# EAGLE design ELEKTRA-PMIC v0.1-20240112 (EAGLE 9.6.2)
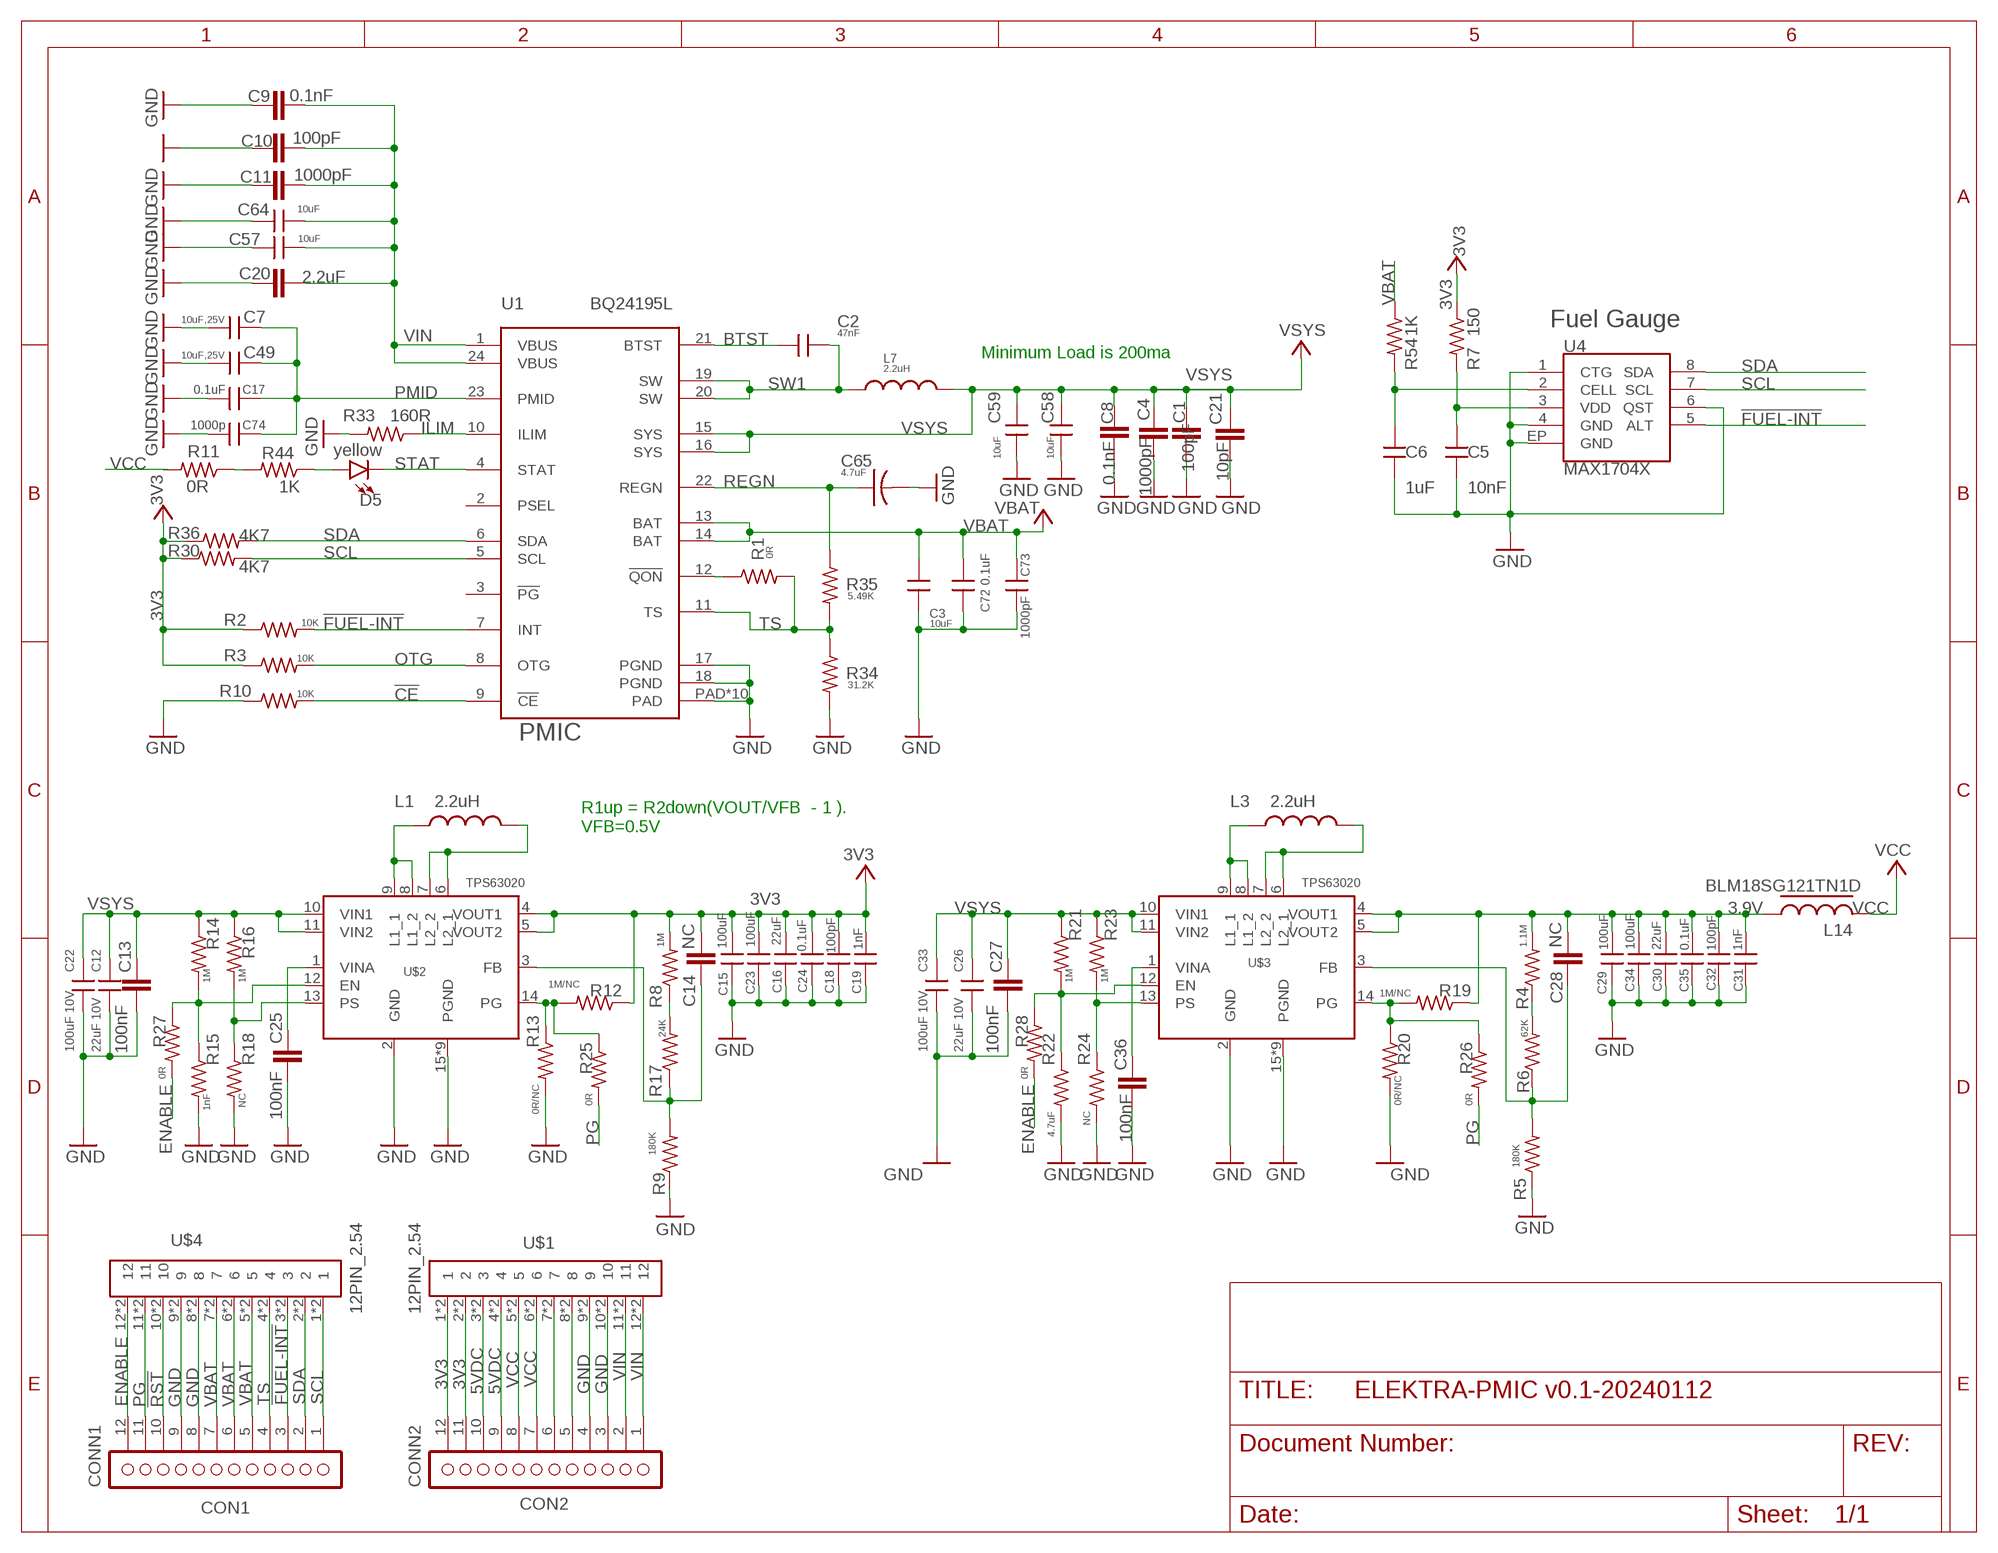
[diagram p0: schematic, sheet 1]

## Parts
C1  100pF  CAP_1  [C0402_B]
C2  47nF  CAP0402  [C-0402]
C3  10uF  CAPC0603  [C0603]
C4  1000pF  CAP_1  [C0402_B]
C5  10nF  CAP0402A  [C0402]
C6  1uF  CAP0402A  [C0402]
C7  10uF,25V  CAP0603A  [C-0603A]
C8  0.1nF  CAP_1  [C0402_B]
C9  0.1nF  CAP_1  [C0402_B]
C10  100pF  CAP_1  [C0402_B]
C11  1000pF  CAP_1  [C0402_B]
C12  22uF 10V  CAPC0805  [C0805]
C13  100nF  CAP_1  [C0402_B]
C14  NC  CAP_1  [C0402_B]
C15  100uF  CAPC1206  [C1206]
C16  22uF  CAP0603A  [C-0603A]
C17  0.1uF  CAP0402A  [C0402]
C18  100pF  CAP0402A  [C0402]
C19  1nF  CAP0402A  [C0402]
C20  2.2uF  CAP_1  [C0402_B]
C21  10pF  CAP_1  [C0402_B]
C22  100uF 10V  CAPC1206  [C1206]
C23  100uF  CAPC1206  [C1206]
C24  0.1uF  CAP0402A  [C0402]
C25  100nF  CAP_1  [C0402_B]
C26  22uF 10V  CAPC0805  [C0805]
C27  100nF  CAP_1  [C0402_B]
C28  NC  CAP_1  [C0402_B]
C29  100uF  CAPC1206  [C1206]
C30  22uF  CAP0603A  [C-0603A]
C31  1nF  CAP0402A  [C0402]
C32  100pF  CAP0402A  [C0402]
C33  100uF 10V  CAPC1206  [C1206]
C34  100uF  CAPC1206  [C1206]
C35  0.1uF  CAP0402A  [C0402]
C36  100nF  CAP_1  [C0402_B]
C49  10uF,25V  CAP0603A  [C-0603A]
C57  10uF  CAP0603A  [C-0603A]
C58  10uF  CAP0603A  [C-0603A]
C59  10uF  CAP0603A  [C-0603A]
C64  10uF  CAP0603A  [C-0603A]
C65  4.7uF  C-US0603  [C0603_B]
C72  0.1uF  CAP0402  [C-0402]
C73  1000pF  CAP0402  [C-0402]
C74  1000p  CAP0402  [C-0402]
CONN1  CON1  CONN12  [1X12_SMD_STRAIGHT]
CONN2  CON2  CONN12  [1X12_SMD_STRAIGHT]
D5  yellow  LED-RED0603  [LED-0603]
L1  2.2uH  INDUCTOR-SPARKFUNVLS3012ET-4R7M  [INDUCTOR-VLS-E]
L3  2.2uH  INDUCTOR-SPARKFUNVLS3012ET-4R7M  [INDUCTOR-VLS-E]
L7  2.2uH  INDUCTORI  [INDUCTOR-4040]
L14  BLM18SG121TN1D  L  [R-0603A]
R1  0R  R-US_  [R0402_B]
R2  10K  R-US_  [R0402_B]
R3  10K  R-US_  [R0402_B]
R4  1.1M  R-US_  [R0402_B]
R5  180K  R-US_  [R0402_B]
R6  62K  R-US_  [R0402_B]
R7  150  R-US_  [R0402_B]
R8  1M  R-US_  [R0402_B]
R9  180K  R-US_  [R0402_B]
R10  10K  R-US_  [R0402_B]
R11  0R  R-US_  [R0402_B]
R12  1M/NC  R-US_  [R0402_B]
R13  0R/NC  R-US_  [R0402_B]
R14  1M  R-US_  [R0402_B]
R15  1nF  R-US_  [R0402_B]
R16  1M  R-US_  [R0402_B]
R17  24K  R-US_  [R0402_B]
R18  NC  R-US_  [R0402_B]
R19  1M/NC  R-US_  [R0402_B]
R20  0R/NC  R-US_  [R0402_B]
R21  1M  R-US_  [R0402_B]
R22  4.7uF  R-US_  [R0402_B]
R23  1M  R-US_  [R0402_B]
R24  NC  R-US_  [R0402_B]
R25  0R  R-US_  [R0402_B]
R26  0R  R-US_  [R0402_B]
R27  0R  R-US_  [R0402_B]
R28  0R  R-US_  [R0402_B]
R30  4K7  R-US_  [R0402_B]
R33  160R  R-US_  [R0402_B]
R34  31.2K  R-US_  [R0402_B]
R35  5.49K  R-US_  [R0402_B]
R36  4K7  R-US_  [R0402_B]
R44  1K  R-US_  [R0402_B]
R54  1K  R-US_  [R0402_B]
U1  BQ24195L  BQ24298RTWR  [QFN24]
U4  MAX1704X  [TDFN-8]
U$1  12PIN_2.54  [12PIN_2.54]
U$2  TPS63020  [TPS63020]
U$3  TPS63020  [TPS63020]
U$4  12PIN_2.54  [12PIN_2.54]

## Nets
3.9V: C28.2 C29.1 C30.1 C31.1 C32.1 C34.1 C35.1 L14.2 R4.2 R19.1 U$3.4(VOUT1) U$3.5(VOUT2)
3V3: C14.2 C15.1 C16.1 C18.1 C19.1 C23.1 C24.1 CONN2.11 CONN2.12 R2.1 R3.1 R7.1 R8.2 R12.1 R30.1 R36.1 U$1.1 U$1.2 U$1.P$1 U$1.P$2 U$2.4(VOUT1) U$2.5(VOUT2)
5VDC: CONN2.9 CONN2.10 U$1.3 U$1.4 U$1.P$3 U$1.P$4
!CE: R10.2 U1.9(!CE)
!FUEL-INT: CONN1.3 R2.2 U1.7(INT) U4.5(ALT) U$4.3 U$4.P$3
!RST: CONN1.10 U$4.10 U$4.P$10
BTST: C2.1 U1.21(BTST)
ENABLE: CONN1.12 R27.2 R28.2 U$4.12 U$4.P$12
GND: C1.1 C3.2 C4.1 C5.2 C6.2 C7.2 C8.1 C9.1 C10.1 C11.1 C12.2 C13.1 C15.2 C16.2 C17.1 C18.2 C19.2 C20.1 C21.1 C22.2 C23.2 C24.2 C25.1 C26.2 C27.1 C29.2 C30.2 C31.2 C32.2 C33.2 C34.2 C35.2 C36.1 C49.2 C57.2 C58.2 C59.2 C64.2 C65.2 C72.2 C73.2 C74.1 CONN1.8 CONN1.9 CONN2.3 CONN2.4 R5.1 R9.1 R10.1 R13.2 R15.2 R18.2 R20.2 R22.2 R24.2 R33.2 R34.2 U1.17(PGND) U1.18(PGND) U1.PAD U1.PAD@1(PAD) U1.PAD@2(PAD) U1.PAD@3(PAD) U1.PAD@4(PAD) U1.PAD@5(PAD) U1.PAD@6(PAD) U1.PAD@7(PAD) U1.PAD@8(PAD) U1.PAD@9(PAD) U4.1(CTG) U4.4(GND) U4.6(QST) U4.EP(GND) U$1.9 U$1.10 U$1.P$9 U$1.P$10 U$2.2(GND) U$2.15(PGND) U$2.16(PGND) U$2.17(PGND) U$2.18(PGND) U$2.19(PGND) U$2.20(PGND) U$2.21(PGND) U$2.22(PGND) U$2.23(PGND) U$3.2(GND) U$3.15(PGND) U$3.16(PGND) U$3.17(PGND) U$3.18(PGND) U$3.19(PGND) U$3.20(PGND) U$3.21(PGND) U$3.22(PGND) U$3.23(PGND) U$4.8 U$4.9 U$4.P$8 U$4.P$9
ILIM: R33.1 U1.10(ILIM)
N$1: R1.1 U1.12(!QON)
N$2: R11.1 R44.2
N$3: D5.A R44.1
N$5: C14.1 R9.2 R17.1 U$2.3(FB)
N$6: C28.1 R5.2 R6.1 U$3.3(FB)
N$7: CONN2.6 U$1.7 U$1.P$7
N$8: R8.1 R17.2
N$9: R4.1 R6.2
N$10: CONN2.5 U$1.8 U$1.P$8
N$11: L3.P$1 U$3.8(L1_2) U$3.9(L1_1)
N$12: L1.P$1 U$2.8(L1_2) U$2.9(L1_1)
N$13: R12.2 R13.1 R25.1 U$2.14(PG)
N$14: R14.2 R15.1 R27.1 U$2.12(EN)
N$15: R16.2 R18.1 U$2.13(PS)
N$16: L3.P$2 U$3.6(L2_1) U$3.7(L2_2)
N$17: L1.P$2 U$2.6(L2_1) U$2.7(L2_2)
N$18: C25.2 U$2.1(VINA)
N$19: C36.2 U$3.1(VINA)
N$20: R19.2 R20.1 R26.1 U$3.14(PG)
N$21: R21.2 R22.1 R28.1 U$3.12(EN)
N$22: R23.2 R24.1 U$3.13(PS)
N$48: C5.1 R7.2 U4.3(VDD)
N$49: C6.1 R54.2 U4.2(CELL)
OTG: R3.2 U1.8(OTG)
PG: CONN1.11 R25.2 R26.2 U$4.11 U$4.P$11
PMID: C7.1 C17.2 C49.1 C74.2 U1.23(PMID)
REGN: C65.1 R35.1 U1.22(REGN)
SCL: CONN1.1 R30.2 U1.5(SCL) U4.7(SCL) U$4.1 U$4.P$1
SDA: CONN1.2 R36.2 U1.6(SDA) U4.8(SDA) U$4.2 U$4.P$2
STAT: D5.C U1.4(STAT)
SW1: C2.2 L7.P$1 U1.19(SW) U1.20(SW)
TS: CONN1.4 R1.2 R34.1 R35.2 U1.11(TS) U$4.4 U$4.P$4
VBAT: C3.1 C72.1 C73.1 CONN1.5 CONN1.6 CONN1.7 R54.1 U1.13(BAT) U1.14(BAT) U$4.5 U$4.6 U$4.7 U$4.P$5 U$4.P$6 U$4.P$7
VCC: CONN2.7 CONN2.8 L14.1 R11.2 U$1.5 U$1.6 U$1.P$5 U$1.P$6
VIN: C9.2 C10.2 C11.2 C20.2 C57.1 C64.1 CONN2.1 CONN2.2 U1.1(VBUS) U1.24(VBUS) U$1.11 U$1.12 U$1.P$11 U$1.P$12
VSYS: C1.2 C4.2 C8.2 C12.1 C13.2 C21.2 C22.1 C26.1 C27.2 C33.1 C58.1 C59.1 L7.P$2 R14.1 R16.1 R21.1 R23.1 U1.15(SYS) U1.16(SYS) U$2.10(VIN1) U$2.11(VIN2) U$3.10(VIN1) U$3.11(VIN2)
Unconnected: U1.2(PSEL) U1.3(!PG)

## Notes on the sheet
- Fuel Gauge
- Minimum Load is 200ma
- PMIC
- R1up = R2down(VOUT/VFB  - 1 ).
  VFB=0.5V

## Library data of the parts
C1 C4 C8-C11 C13 C14 C20 C21 C25 C27 C28 C36 = Particle:CAP_1
C2 C3 C5-C7 C12 C15 C16 C18 C19 C22-C24 C26 C29-C35 C49 C57-C59 C64 C72-C74 = particle SZ:CAP: CAP
C17 = RedBear:CAP: CAP
C65 = Bretts-Spark-Library:C-US: Capacitor
CONN1 CONN2 = particle-studios:CONN12
D5 = SparkFun-LED:LED-RED: Red SMD LED Used in manufacturing of most products at SparkFun Packages: 0603 - SMD 0603 package [Product Link] <http://docs.avagotech.com/docs/AV02-0551EN> 0603 SMART - SMD 0603 SMART package ( more efficient and expensive)[Product Link] <http://www.osram-os.com/Graphics/XPic2/00077099_0.pdf> 1206 - SMD1206 package [Product Link] <https://www.sparkfun.com/datasheets/DevTools/LilyPad/Q150OVS4.pdff> SparkFun Products: Pro Mini 328 -5V <https://www.sparkfun.com/products/821> RedBoard <https://www.sparkfun.com/products/12757> IOIO-OTG <https://www.sparkfun.com/products/13613>; PROD_ID: DIO-00819; VALUE: RED
L1 L3 = Particle:INDUCTOR-SPARKFUN: Inductors Basic Inductor/Choke - 0603 and 1206. Footprints are not proven and vary greatly between part numbers. SRN6045- 33uH, 20% 1.4A
L7 = Particle:INDUCTOR
L14 = particle SZ:L
R1-R6 R8-R10 R12-R28 R34 R35 = Spark:R-US_: 0402 Resistor
R7 R11 R30 R33 R36 R44 R54 = Particle:R-US_: 0402 Resistor
U1 = electron:BQ24298RTWR: Bq24298 I2C Controlled 3A Single Cell USB Charger with Narrow VDC Power Path Management and Adjustable Voltage USB OTG
U4 = SparkFun-PowerIC:MAX1704X: MAX17043/MAX17044: Battery Fuel Guage (43 is 1cell, 44 is 2cell)
U$1 U$4 = particle SZ:12PIN_2.54
U$2 U$3 = particle SZ:TPS63020

## Net classes
0 default: width 0.152 mm, drill 0.203 mm, clearance 0.152 mm
1 power: width 0.254 mm, drill 0.203 mm, clearance 0.203 mm
3 BAT: drill 0.203 mm, clearance 0.203 mm
4 3V3: width 0.305 mm, drill 0.203 mm, clearance 0.508 mm
6 +3V3: width 0.203 mm, drill 0.203 mm, clearance 0.152 mm

## Board
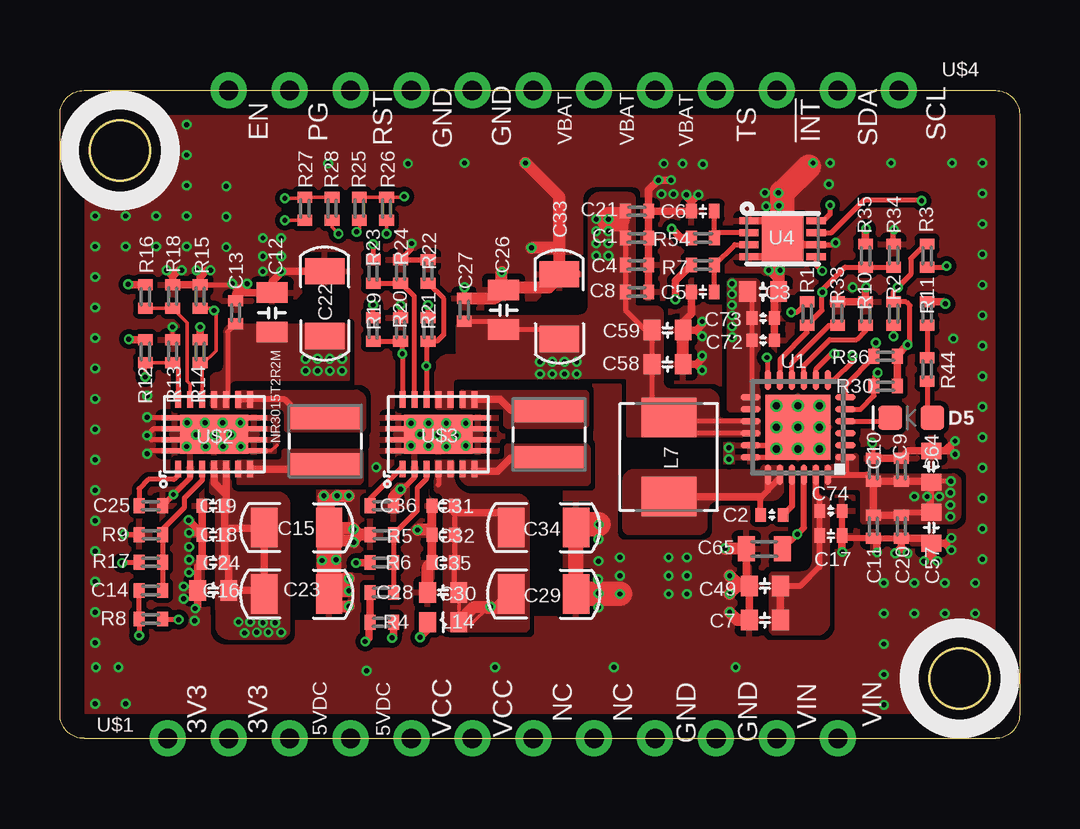
[diagram p1: board, top side]
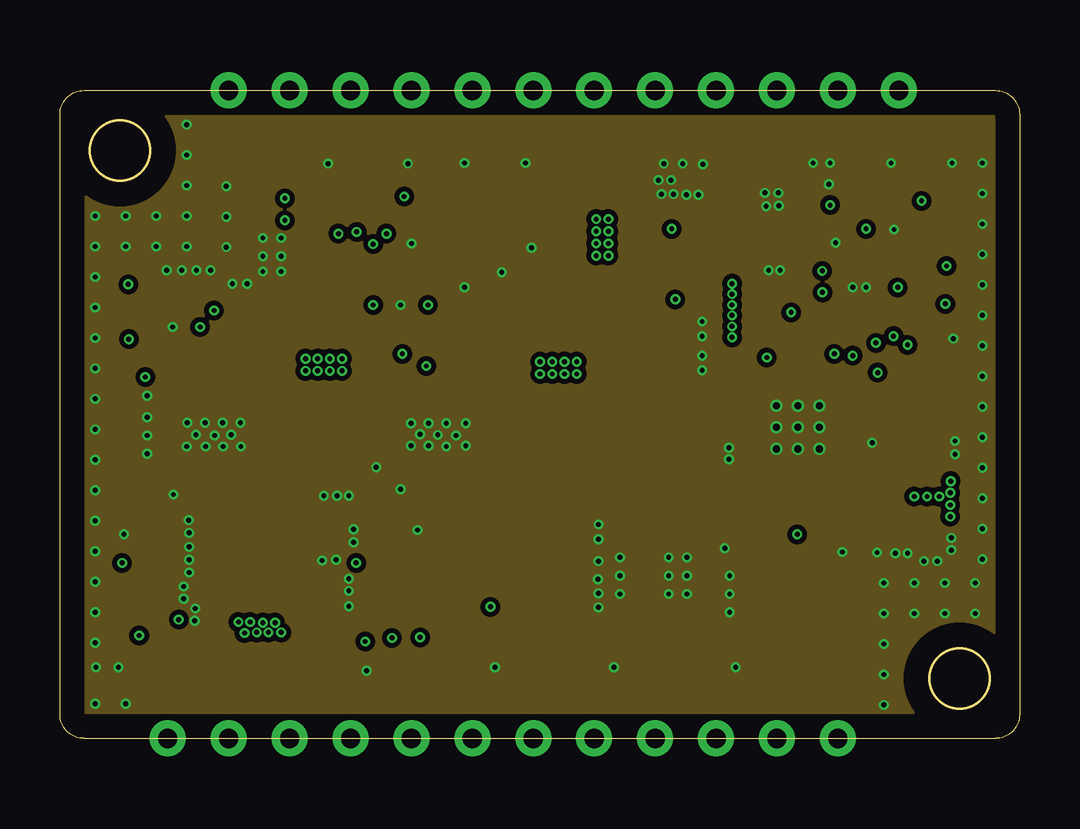
[diagram p2: board, inner layer Route2]
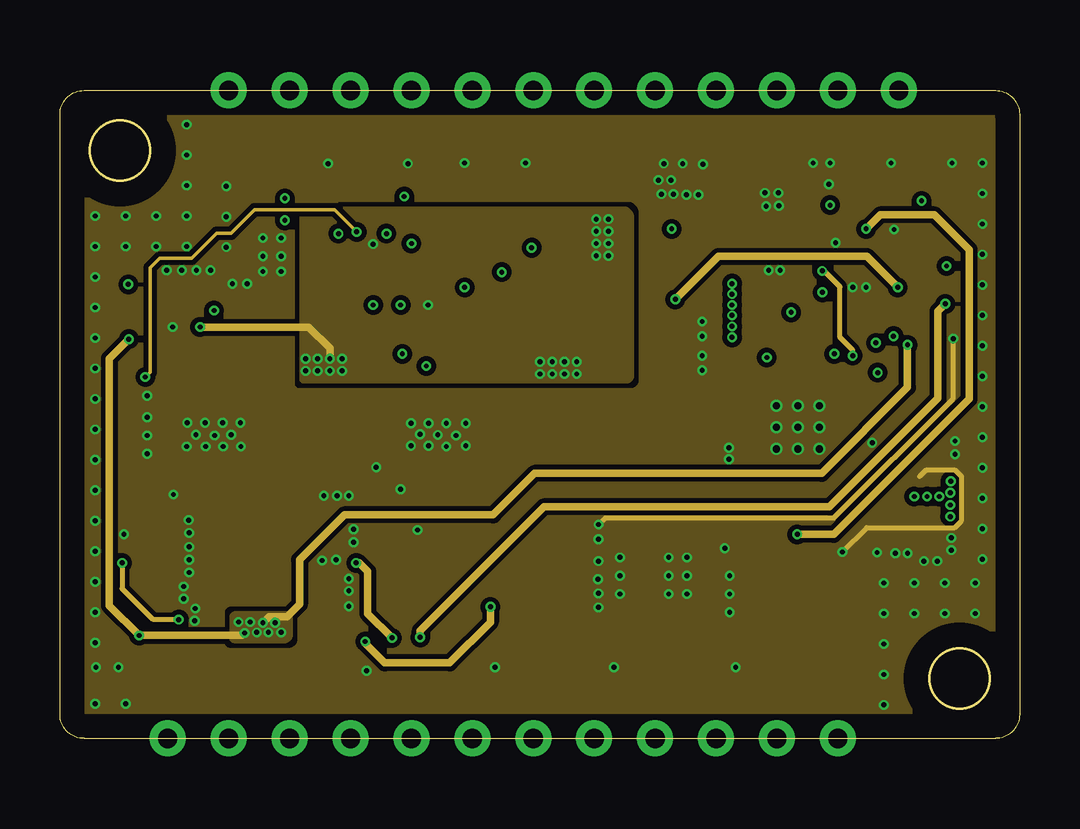
[diagram p3: board, inner layer Route15]
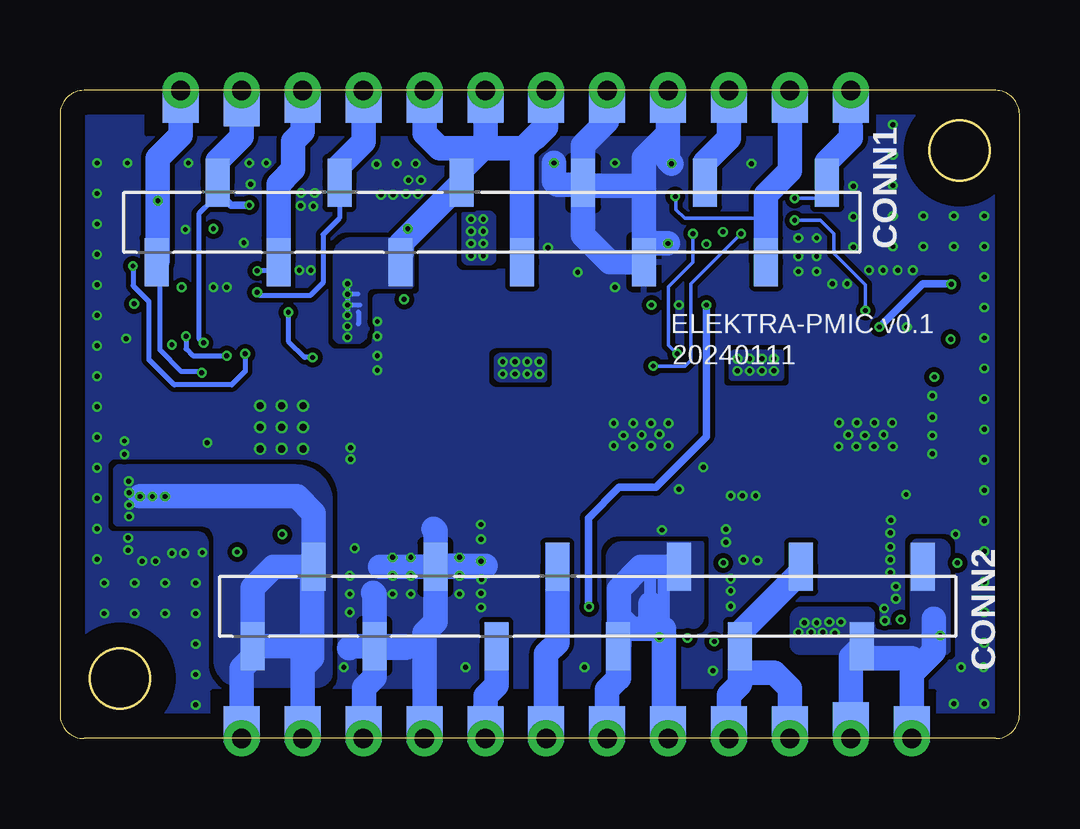
[diagram p4: board, bottom side, seen from below]

Size 40 x 27 mm. Coordinates in mm from the lower left corner, seen from the top.
Outline: 1,0 39,0 arc90 40,1 40,26 arc90 39,27 1,27 arc90 0,26 0,1 arc90 1,0
Outline: circle at 2.5,24.5 radius 1.25
Outline: circle at 37.5,2.5 radius 1.25
Copper layers (1+2*15+16): Top 0.035mm / dielectric 1.5mm / Route2 0.035mm / dielectric 0.15mm / Route15 0.035mm / dielectric 0.2mm / Bottom 0.035mm
Design rules "default *": minimum track width 4mil, minimum drill 8mil, track to track 8mil, track to pad 6mil, pad to pad 6mil, via to via 6mil, smd to smd 6mil, copper to edge 40mil, drill to drill 6mil, minimum pad ring 4mil, minimum via ring 4mil, stop-mask expansion 4mil, vias tented up to drill 16mil, thermal gap 10mil

### Footprints (pad centres in the part's own frame; a part is rotated, then mirrored left to right if it is on the bottom)
C0402_B = smd 0.457 x 0.61: 1 -0.483,0; 2 0.483,0
C-0402 = smd 0.45 x 0.55: 1 -0.47,0; 2 0.47,0
C0603 = smd 0.7 x 0.85: 1 -0.65,0; 2 0.65,0
C0402 = smd 0.45 x 0.6: 1 -0.47,0; 2 0.47,0
C-0603A = smd 0.7 x 0.85: 1 -0.65,0; 2 0.65,0
C0805 = smd 0.85 x 1.3: 1 -0.8,0; 2 0.85,0
C1206 = smd 1.1 x 1.65: 1 -1.35,0; 2 1.35,0
C0603_B = smd 0.711 x 1.041: 1 -0.749,0; 2 0.749,0
1X12_SMD_STRAIGHT = smd 1 x 2: 1 13.97,1.65; 2 11.43,-1.65; 3 8.89,1.65; 4 6.35,-1.65; 5 3.81,1.65; 6 1.27,-1.65; 7 -1.27,1.65; 8 -3.81,-1.65; 9 -6.35,1.65; 10 -8.89,-1.65; 11 -11.43,1.65; 12 -13.97,-1.65
LED-0603 = smd 1 x 1: A -0.877,0; C 0.877,0
INDUCTOR-VLS-E = smd 1 x 3: P$1 -1,0; P$2 1,0
INDUCTOR-4040 = smd 1.65 x 2.3: P$1 -1.65,0; P$2 1.65,0
R-0603A = smd 0.7 x 0.85: 1 -0.65,0; 2 0.65,0
R0402_B = smd 0.457 x 0.61: 1 -0.483,0; 2 0.483,0
QFN24 = smd 0.85 x 0.28: 1 -1.975,1.25; 2 -1.975,0.75; 3 -1.975,0.25; 4 -1.975,-0.25; 5 -1.975,-0.75; 6 -1.975,-1.25; 13 1.975,-1.25; 14 1.975,-0.75; 15 1.975,-0.25; 16 1.975,0.25; 17 1.975,0.75; 18 1.975,1.25 | smd 0.28 x 0.85: 7 -1.25,-1.975; 8 -0.75,-1.975; 9 -0.25,-1.975; 10 0.25,-1.975; 11 0.75,-1.975; 12 1.25,-1.975; 19 1.25,1.975; 20 0.75,1.975; 21 0.25,1.975; 22 -0.25,1.975; 23 -0.75,1.975; 24 -1.25,1.975 | smd 2.7 x 2.7: PAD 0,0 | drill 0.3 pad 0.406: PAD@1 -0.9,0.9; PAD@2 0,0.9; PAD@3 0.9,0.9; PAD@4 -0.9,0; PAD@5 0,0; PAD@6 0.9,0; PAD@7 -0.9,-0.9; PAD@8 0,-0.9; PAD@9 0.9,-0.9
TDFN-8 = smd 0.8 x 0.3: 1 -1.4,0.75; 2 -1.4,0.25; 3 -1.4,-0.25; 4 -1.4,-0.75; 5 1.4,-0.75; 6 1.4,-0.25; 7 1.4,0.25; 8 1.4,0.75 | smd 1.73 x 1.88: EP 0,0
12PIN_2.54 = drill 0.8 pad 1.5: 1 -13.97,0; 2 -11.43,0; 3 -8.89,0; 4 -6.35,0; 5 -3.81,0; 6 -1.27,0; 7 1.27,0; 8 3.81,0; 9 6.35,0; 10 8.89,0; 11 11.43,0; 12 13.97,0 | smd 1.5 x 1.5 bottom: P$1 -13.97,0.6; P$2 -11.43,0.75; P$3 -8.89,0.6; P$4 -6.35,0.6; P$5 -3.81,0.6; P$6 -1.27,0.6; P$7 1.27,0.6; P$8 3.81,0.6; P$9 6.35,0.6; P$10 8.89,0.6; P$11 11.43,0.6; P$12 13.97,0.6
TPS63020 = smd 0.25 x 0.7: 1 -1.5,-1.45; 2 -1,-1.45; 3 -0.5,-1.45; 4 0,-1.45; 5 0.5,-1.45; 6 1,-1.45; 7 1.5,-1.45; 8 1.5,1.45; 9 1,1.45; 10 0.5,1.45; 11 0,1.45; 12 -0.5,1.45; 13 -1,1.45; 14 -1.5,1.45 | smd 1.1 x 0.2: 15 -1.65,0.69; 16 -1.65,0.23; 17 -1.65,-0.23; 18 -1.65,-0.69; 19 1.65,-0.69; 20 1.65,-0.23; 21 1.65,0.23; 22 1.65,0.69 | smd 2.85 x 1.58: 23 0,0

### Placement (x,y rotation side)
C1  24.06,20.86 180 top
C2  29.68,9.32 180 top
C3  29.31,18.62 0 top
C4  24.06,19.73 180 top
C5  26.8,18.61 180 top
C6  26.8,21.97 180 top
C7  29.39,4.93 180 top
C8  24.06,18.61 180 top
C9  35.07,11.2 270 top
C10  33.91,11.2 270 top
C11  33.91,8.83 90 top
C12  8.84,17.73 90 top
C13  7.32,17.76 270 top
C14  3.79,6.17 180 top
C15  9.87,8.78 0 top
C16  6.39,6.17 180 top
C17  32.13,8.45 180 top
C18  6.39,8.49 180 top
C19  6.39,9.7 180 top
C20  35.07,8.83 90 top
C21  24.06,21.97 180 top
C22  11.04,18.12 90 top
C23  9.87,6.01 0 top
C24  6.39,7.34 180 top
C25  3.79,9.7 180 top
C26  18.49,17.84 90 top
C27  16.86,17.87 270 top
C28  13.41,6.08 180 top
C29  20.16,6.01 0 top
C30  15.98,6.08 180 top
C31  15.98,9.7 180 top
C32  15.98,8.49 180 top
C33  20.82,17.99 90 top
C34  20.16,8.78 0 top
C35  15.98,7.33 180 top
C36  13.41,9.7 180 top
C49  29.39,6.36 180 top
C57  36.32,8.78 270 top
C58  25.33,15.59 0 top
C59  25.33,17.01 0 top
C64  36.32,11.33 90 top
C65  29.37,7.9 180 top
C72  29.31,16.6 0 top
C73  29.31,17.52 0 top
C74  32.13,9.48 180 top
CONN1  22,21.5 180 bottom
CONN2  18,5.5 180 bottom
D5  35.49,13.36 180 top
L1  1.5uH  [INDUCTOR-VLS-E]  11.05,12.38 270 top
L3  1uH  [INDUCTOR-VLS-E]  20.39,12.67 270 top
L7  25.38,11.73 90 top
L14  15.98,4.84 0 top
R1  31.15,17.71 270 top
R2  34.74,17.71 270 top
R3  36.15,20.12 270 top
R4  511K  [R0402_B]  13.41,4.84 180 top
R5  91K  [R0402_B]  13.41,8.49 0 top
R6  511K  [R0402_B]  13.41,7.33 180 top
R7  26.8,19.73 0 top
R8  511K  [R0402_B]  3.79,4.97 180 top
R9  91K  [R0402_B]  3.79,8.49 0 top
R10  33.58,17.71 270 top
R11  NC  [R0402_B]  36.15,17.71 90 top
R12  3.56,16.13 270 top
R13  4.7,16.13 90 top
R14  5.84,16.13 270 top
R15  NC  [R0402_B]  5.84,18.41 90 top
R16  NC  [R0402_B]  3.56,18.41 270 top
R17  511K  [R0402_B]  3.79,7.34 180 top
R18  1M  [R0402_B]  4.7,18.41 90 top
R19  13.06,17.04 270 top
R20  14.2,17.04 90 top
R21  15.34,17.04 270 top
R22  NC  [R0402_B]  15.34,19.46 90 top
R23  NC  [R0402_B]  13.06,19.46 270 top
R24  1M  [R0402_B]  14.2,19.46 90 top
R25  12.48,22.07 90 top
R26  13.61,22.07 90 top
R27  10.21,22.07 90 top
R28  11.35,22.07 90 top
R30  34.41,14.68 180 top
R33  32.42,17.71 90 top
R34  31.23K  [R0402_B]  34.74,20.12 90 top
R35  5.52K  [R0402_B]  33.58,20.12 270 top
R36  34.41,15.93 180 top
R44  36.15,15.37 90 top
R54  26.8,20.86 0 top
U1  30.76,12.97 180 top
U4  30.12,20.83 0 top
U$1  18.46,0 0 top
U$2  6.44,12.68 0 top
U$3  15.77,12.68 0 top
U$4  21,27 180 top

### Tracks (layer width: path | path; a pad name or v marks a point on that pad's centre or on a via)
3.9V  (via drill 0.2 pad 0.41)
  Top 0.152: 16.63,5.97 L14.2 17.23,4.84 17.81,5.43 | 19.2,5.41 19.13,5.49 v17.95,5.49 17.89,5.43
  Top 0.203: R19.1 v13.06,18.06 | U$3.4 15.77,10.57 | 16.45,9.89 C31.1 16.45,9.4 C32.1 C35.1 16.45,6.26 C30.1 16.63,5.97 16.63,5.89
  Top 0.305: C34.1 18.81,8.96 18.38,9.4 16.45,9.4 | 16.67,6.01 16.63,5.97 | C28.2 R4.2 12.88,4.79 12.88,4.2 v12.72,4.04
  Top 0.508: C29.1 18.23,5.43 17.89,5.43 17.81,5.43 | L14.2 17.27,5.49 v17.95,5.49
  Route15 0.305: v12.72,4.04 12.72,3.96 13.54,3.15 16.25,3.15 17.95,4.85 v17.95,5.49
  Bottom 0.305: v13.06,18.06 13.06,12.57 15.16,10.46 16.69,10.46 17.97,9.18 17.97,5.51 v17.95,5.49
  pour Top (no thermals): 15.65,11.58 16.31,11.58 arc-90 16.38,11.51 16.38,10.95 arc90 17.17,10.16 19.05,10.16 arc-90 19.51,9.7 19.51,4.57 arc-90 19.46,4.52 arc-90 19.41,4.47 16.36,4.47 arc-90 16.03,4.8 16.03,10.01 15.85,10.19 arc90 15.85,10.21 arc-90 15.65,10.41
3V3  (via drill 0.2 pad 0.41)
  Top 0.152: 2.9,16.61 v2.87,16.64
  Top 0.203: C14.2 R8.2 v3.31,4.3 v3.3,4.29 | R30.1 R36.1 35.43,16.46 35.43,18.03 35.28,18.19 R2.1 34.74,18.62 v34.92,18.8 35.46,19.33 35.46,20 36.07,20.6 R3.1
  Top 0.305: 2.9,16.61 R12.1 | 6.86,8.76 C18.1 C24.1 7.04,7.16 C16.1 8.36,6.17 C23.1 C15.1 8.5,8.76 6.86,8.76 | 6.86,8.76 6.86,9.4 | 6.86,9.4 C19.1 | U$2.5 6.94,10.16 | 6.94,10.16 6.94,9.47 6.86,9.4 | U$2.4 6.44,10.66 6.94,10.16 | R7.1 25.65,19.07 v25.65,18.3 | v35.33,16.4 34.9,15.97 R30.1
  Route15 0.152: v25.65,18.3 25.67,18.3
  Route15 0.203: v7.44,4.85 7.44,4.88 | 7.59,4.29 v7.7,4.39
  Route15 0.305: v35.33,16.4 35.33,14.63 31.75,11.05 19.79,11.05 18.06,9.32 11.86,9.32 9.98,7.44 9.98,5.59 9.47,5.08 8.71,5.08 v8.46,4.83 | 25.67,18.3 27.46,20.09 32.18,20.09 33.63,20.09 v34.92,18.8 | v2.87,16.64 2.06,15.82 2.06,5.54 v3.3,4.29 7.59,4.29
  Bottom 1.016: U$1.P$1 4.49,2.72 | 4.49,2.72 4.49,3.34 6.57,3.34 CONN2.11 7.03,3.39 U$1.P$2 U$1.2 | 4.49,2.72 3.58,3.63 3.58,4.98
  Bottom 1.27: U$1.1 U$1.P$1
  other vias: 9.22,4.42 8.69,4.42 8.2,4.42 7.92,4.85 8.97,4.83
  pour Top (no thermals): 6.32,11.56 7.04,11.56 arc-90 7.09,11.51 7.09,10.59 arc90 7.44,10.24 9.07,10.24 arc-90 9.53,9.78 9.53,4.5 arc-90 9.19,4.17 7.06,4.17 arc-90 6.55,4.67 6.55,5.36 arc-90 6.53,5.38 6.53,10.06 arc90 6.38,10.21 arc-90 6.27,10.31 6.27,11.51 arc-90
  pour Route15: 7.26,4.04 9.37,4.04 arc90 9.65,4.32 9.65,5.08 arc90 9.5,5.23 7.29,5.23 arc90 7.11,5.05 7.11,4.19 arc90
  pour Bottom (no thermals): 3.3,8.26 4.27,8.26 arc-90 4.52,8 4.52,4.62 arc90 4.67,4.47 5.82,4.47 arc90 6.07,4.72 6.07,5.13 arc-90 6.38,5.44 9.09,5.44 arc-90 9.53,5 9.53,3.91 arc-90 9.17,3.56 3.07,3.56 arc-90 2.93,3.7 2.93,7.88 arc-90
5VDC
  Bottom 1.016: U$1.4 U$1.P$4 12.11,1.81 11.65,2.27 11.65,2.74 | U$1.3 U$1.P$3 9.57,2.1 10.21,2.74 11.65,2.74 | CONN2.9 11.65,3.19 | 11.65,2.74 CONN2.9 | CONN2.9 11.65,4.41 9.11,6.95 CONN2.10
!CE
  Top 0.203: U1.9 30.99,14.96 30.99,15.52 32.09,16.61 33.21,16.61 33.58,16.98 R10.2
!FUEL-INT  (via drill 0.2 pad 0.41)
  Top 0.203: U1.7 32.29,14.94 33.05,15.7 v33.05,15.95 | R2.2 v34.74,16.77 v34.75,16.76 | U4.5 31.52,19.74 v31.77,19.48
  Route15 0.203: v33.05,15.95 33.05,16.18 32.51,16.71 32.51,18.82 31.85,19.48 v31.77,19.48
  Bottom 0.152: U$4.P$3 30.28,26.01
  Bottom 0.203: v34.75,16.76 34.75,16.23 34.47,15.95 v33.05,15.95 | v31.77,19.48 31.26,19.48 CONN1.3
  Bottom 1.016: 29.89,26.04 29.89,25.28 30.28,24.89 30.28,23.71 30.89,23.1 CONN1.3 | U$4.P$3 U$4.3
  Bottom 1.27: U$4.3 29.89,26.04
!RST
  Bottom 1.016: CONN1.10 13.11,24 12.11,25 12.11,25.18 U$4.P$10 U$4.10
BTST
  Top 0.254: U1.21 30.51,9.68 C2.1
ENABLE  (via drill 0.2)
  Top 0.152: R28.2 R27.2 10.16,22.5 v9.37,22.5
  Bottom 0.152: U$4.P$12 7.03,25.47 | v9.37,22.5 8.17,22.5 8.03,22.64 CONN1.12
  Bottom 1.016: CONN1.12 8.03,24.02 7.03,25.02 7.03,25.47
  Bottom 1.27: U$4.12 U$4.P$12
GND  (via drill 0.2, 0.2 pad 0.41)
  Top 0.152: R13.2 v4.7,17.14 | C10.1 33.91,12.27 v33.86,12.32 | C74.1 32.6,7.78 v32.61,7.77 | U$2.17 6.21,12.45 U$2.23 | U$2.20 6.86,12.45 | 6.86,12.45 6.67,12.45 | 6.67,12.45 U$2.23 | U$2.21 6.67,12.91 | 6.67,12.91 U$2.23 | 6.67,12.45 7.13,11.99 U$2.19 8.81,11.99 9.04,12.22 | U$2.22 7.13,13.37 6.67,12.91 | U$2.15 5.75,13.37 U$2.23 | U$2.23 6.63,12.68 6.86,12.45 | U$3.23 15.79,12.68 16.02,12.91 U$3.21 15.54,12.91 | U$3.22 16.41,13.37 15.77,12.73 U$3.23 | U$3.17 14.65,12.45 14.71,12.5 14.71,13.06 v14.63,13.13 15.31,13.13 15.54,12.91 | U$3.23 15.54,12.91 | U$3.20 16.69,12.45 v16.51,12.62 | U$3.19 16.28,11.99 v16.1,12.17
  Top 0.203: R22.2 R24.2 14.66,20.4 v14.66,20.62 | R20.2 v14.2,18.06 | 20.14,18.8 20.69,19.34 C33.2 20.93,19.34 21.45,19.34 | U$3.2 14.77,10.89 13.9,10.02 | 13.9,10.07 13.9,10.02 | 13.9,10.02 C36.1 | U$2.2 5.44,10.86 C25.1 4.28,9.71 v4.73,10.17 | 15.48,7.3 C35.2 C32.2 15.51,8.71 | 15.51,9.58 C31.2 | 24.54,20.83 C1.1 | 29.96,18.39 C3.2 | U1.17 29.71,12.21 U1.PAD@3 29.51,11.71 U1.18 | 33.58,18.77 v33.6,18.8 | R34.2 34.74,21.21 34.75,21.21 v34.77,21.21 | 5.89,18.9 7.14,18.9 v7.19,18.95 | C27.1 16.86,18.79 v16.87,18.8 | 27.74,7.9 v27.71,7.92 | R9.1 2.69,8.49 v2.67,8.51 | U4.6 32.33,20.58 v32.33,20.65 | 11.5,5.73 C23.2 | v3.63,13.39 3.65,13.37 U$2.15 5.43,13.37 5.59,13.21 5.29,12.91 U$2.16 3.91,12.91 v3.63,12.62 3.81,12.45 U$2.17 5.59,12.45 5.71,12.32 5.38,11.99 U$2.18 3.75,11.99 v3.63,11.86
  Top 0.254: C74.1 C17.1 32.71,8.35 C11.1 C20.1
  Top 0.305: R15.2 R18.2 4.7,19.25 | 7.54,18.6 v7.19,18.95 | v7.8,18.95 7.74,18.95 7.33,18.53 C13.1 7.33,18.48 7.43,18.58 C12.2 8.84,19.04 9.27,19.47 C22.2 | C64.2 35.37,11.98 C9.1 C10.1 | C7.2 C49.2 28.82,6.36 28.62,6.56 C65.2 | C19.2 C18.2 | C18.2 C24.2 5.74,7.16 C16.2 5.74,5.51 v5.64,5.42 | C36.1 13.9,9.95 14.2,10.25 v14.2,10.39 | C5.2 26.33,17.69 25.98,17.34 C59.2 26.52,17.01 | C57.2 36.11,8.35 C20.1 35.07,7.97 | C64.2 37.17,11.98 v37.31,11.84 | C64.2 36.9,11.98 v37.31,12.4 | C57.2 36.88,8.13 | 36.88,8.13 v37.16,7.85 | 36.88,8.13 36.94,8.13 v37.16,8.36 | C57.2 36.32,7.7 | 36.32,7.7 v36.02,7.39 | 36.32,7.7 36.32,7.64 v36.58,7.39 | 4.7,19.25 v4.45,19.51 | 4.7,19.25 4.95,19.51 v5.08,19.51 | R15.2 5.89,18.9 | v5.69,19.51 5.84,19.36 R15.2 | v6.27,19.51 6.12,19.51 5.84,19.23 R15.2 | C18.2 5.84,8.56 v5.39,8.56 | C18.2 5.92,8.54 v5.36,9.1 | 35.07,7.97 v34.82,7.72 | 35.07,7.97 v35.32,7.72 v35.33,7.72 | C11.1 34.06,8.19 v34.06,7.75 | 26.33,22.36 C6.2 C21.1 | v26.62,22.66 26.33,22.36 | 26.33,22.36 26.11,22.58 v26.11,22.66 | C21.1 24.54,22.86 v24.94,23.27 v25.48,23.27 | C8.1 C4.1 24.54,20.83 | C1.1 C21.1 | C17.1 32.6,7.78 | 26.52,17.01 v26.77,16.76 | 26.52,17.01 26.77,17.26 v26.77,17.37 | C58.2 26.52,15.59 | 26.52,15.59 v26.77,15.34 | 26.52,15.59 26.77,15.84 v26.77,15.95 | C72.2 C73.2 29.78,18.21 29.96,18.39 | C3.2 29.96,19.09 v29.54,19.51 | 33.58,18.77 R10.1 R33.2 | C31.2 15.51,8.71 | U4.6 30.37,20.58 U4.EP | U4.4 29.7,20.08 29.77,20.14 | U4.1 29.98,21.58 30.12,21.44 | 31.21,23.83 31.36,23.98 v31.39,23.98
  Top 0.381: C35.2 15.51,8.71 15.51,9.58
  Top 0.457: v14.2,10.39 14.2,10.37 13.9,10.07
  Top 0.508: 21.51,8.33 C34.2 | C27.1 18.15,18.35 C26.2 | C26.2 18.6,18.8 20.14,18.8 20.38,18.8 20.93,19.34 | C26.2 18.41,18.77 v18.41,19.43 | C33.2 21.45,19.34 | C33.2 20.82,22.57 v19.41,23.98 | C33.2 20.82,20.43 20.8,20.45 v19.66,20.45 | v27.91,6.78 28.34,6.36 C49.2 28.25,6.36 v27.91,6.02 | C65.2 27.74,7.9 | C7.2 28.24,4.93 v27.91,5.26 | 15.31,8.69 v14.91,8.69 | C30.2 15.33,7.15 15.48,7.3 | R5.1 12.47,8.49 | 12.47,8.49 v12.24,8.71 12.17,8.78 C15.2 | 12.47,8.49 12.24,8.27 | 12.24,8.27 v12.24,8.18 | C15.2 11.73,8.27 12.24,8.27 | C15.2 11,9 v11,10.11 | C15.2 11.22,9.77 v11.56,10.11 v12.04,10.11 | v12.04,6.15 11.35,6.15 C23.2 11.86,6.66 v12.04,6.66 | v12.04,5.51 11.5,5.51 11.5,5.73 | C58.2 C59.2 | U4.EP 29.96,20.67 C3.2
  Top 0.635: C29.2 21.51,8.33
  Top 1.016: C34.2 21.65,8.92 v22.45,8.92 | C29.2 21.52,6.02 v23.34,6.02 | C15.2 C23.2 | U4.EP 30.12,21.44 30.12,22.74 | 30.12,22.74 30.1,22.76 | 30.12,22.74 31.21,23.83
  Route15 0.203: v22.45,8.92 22.73,9.2 32.27,9.2 37.24,14.16 v37.24,16.66 | v32.61,7.77 33.63,8.79 37.3,8.79 37.59,9.08 37.59,10.91 37.32,11.18 36.09,11.18 35.84,10.92
  Bottom 0.508: U$4.9 14.65,25.2
  Bottom 0.762: U$4.P$8 17.19,25.78
  Bottom 1.016: 14.65,26.04 14.65,25.2 15.65,24.2 15.65,23.04 | 15.65,23.04 CONN1.9 | 17.19,25.78 17.19,25.71 18.19,24.71 CONN1.8 | U$1.P$9 24.81,4.4 24.35,4.86 CONN2.4 | CONN2.4 26.66,7.15 | CONN2.4 22.29,7.15 22.25,7.19 24.31,7.19 CONN2.4 | CONN2.4 24.35,8.65 24.43,8.74 | CONN1.8 18.19,20.96 17.08,19.85 CONN1.9 | CONN1.8 18.08,23.04 15.65,23.04 | CONN1.8 18.28,23.06 19.25,23.06 19.41,23.22 v19.41,23.98 | v14.66,20.62 15.52,20.62 15.65,20.49 CONN1.9 | v14.5,23.95 14.65,24.1 U$4.9 U$4.P$9 | U$1.P$10 27.33,0.62 27.33,2.11 26.89,2.55 CONN2.3 | CONN2.3 25.64,3.85 25.58,3.79 26.82,3.79 CONN2.3 | CONN2.3 27.85,3.85 27.94,3.76 | CONN2.3 26.89,6.01 26.95,6.07
  Bottom 1.27: U$1.9 U$1.P$9 | U$4.8 U$4.P$8 | U$4.9 14.65,26.04 | U$1.10 27.33,0.02 27.33,0.62
  other vias: 15.37,13.13 16.1,13.13 16.92,13.13 15.01,12.67 15.75,12.65 14.63,12.19 15.37,12.19 16.92,12.19 5.31,13.16 6.05,13.16 6.78,13.16 7.52,13.16 5.66,12.65 6.45,12.63 7.14,12.65 5.28,12.17 6.07,12.17 6.81,12.17 7.54,12.17 1.47,20.5 11.18,23.95 38.46,23.98 2.74,20.5 4.01,20.5 5.28,20.5 6.93,20.47 1.47,19.23 1.47,17.96 1.47,16.69 1.47,15.42 1.47,14.15 1.47,12.88 1.47,11.61 1.47,10.34 1.47,9.07 1.47,7.8 1.47,6.53 1.47,5.26 1.47,3.99 38.46,22.71 38.46,21.44 38.46,20.17 38.46,18.9 38.46,17.63 38.46,16.36 38.46,15.09 38.46,13.82 38.46,12.55 38.46,11.28 38.46,10.01 38.46,8.74 38.46,7.47 34.34,6.48 35.61,6.48 36.88,6.48 38.15,6.48 5.28,21.77 5.28,23.04 5.28,24.31 5.28,25.58 4.01,21.77 2.74,21.77 1.47,21.77 1.5,2.97 1.47,1.45 2.74,1.45 34.34,5.21 34.34,3.94 35.61,5.21 36.88,5.21 38.15,5.21 34.34,2.67 34.34,1.4 37.19,23.98 34.65,23.98 32.11,23.98 25.17,23.95 16.87,23.98 6.93,21.74 6.93,23.01 2.44,2.97 12.78,2.82 18.14,2.97 23.09,2.97 28.17,2.97 8.46,19.46 9.22,19.46 11.51,7.44 8.46,20.09 9.22,20.09 8.46,20.85 9.22,20.85 3.63,14.28 27.89,12.12 27.89,11.63 25.37,7.55 25.37,6.78 23.34,7.55 23.34,6.78 25.37,6.02 26.14,7.55 26.14,6.78 26.14,6.02 10.92,7.42 13.18,11.3 22.45,8.31 22.45,7.39 22.43,6.63 22.45,6.05 22.45,5.46 5.39,6.91 5.16,6.33 5.62,4.91 25.58,22.68 25.07,22.68 25.96,23.95 26.8,23.93 30.02,19.51 33.05,18.8 32.05,23.09 29.44,22.17 29.97,22.2 29.39,22.73 29.95,22.73 5.39,7.98 5.39,7.45 5.16,5.82
  pour Bottom (rank 3): -1.7,29.34 47.42,29.34 47.42,-1.55 -1.7,-1.55
  pour Top (rank 3): -4.7,31.57 42.57,31.57 42.57,-3.81 -4.7,-3.81
  pour Route2: -3.73,30.63 44.27,30.63 44.27,-3.23 -3.73,-3.23
  cutout Top: 23.34,12.4 27.58,12.4 27.58,11.33 23.34,11.33
  cutout Top: 18.62,12.83 22.17,12.83 22.17,12.37 18.62,12.37
  cutout Top: 9.22,12.7 12.85,12.7 12.85,12.14 9.22,12.14
  cutout Top: 9.65,10.29 10.62,10.29 10.62,4.98 9.65,4.98
  cutout Top: 19.63,10.24 20.9,10.24 20.9,5.16 19.63,5.16
  cutout Bottom: 21.44,19.96 21.74,19.96 21.74,19.63 21.44,19.63
  cutout Top: 17.73,18.16 19.86,18.16 20.29,18.59 21.82,18.59 21.82,17.81 17.73,17.81
  pour Route15 (rank 3): -2.9,29.97 45.82,29.97 45.82,-2.44 -2.9,-2.44
  cutout Top: 8.38,18.03 9.65,18.03 10.41,18.8 10.95,18.8 11.96,18.8 12.01,18.75 12.01,17.42 8.18,17.42 8.15,17.45 8.15,18.03
  cutout Top: 12.7,17.3 12.7,16.87 13.36,16.87 13.36,17.3
  cutout Top: 13.16,7.72 13.16,3.84 13.69,3.84 13.69,7.8 13.18,7.8 13.16,7.8
  cutout Bottom: 3.73,1.98 33.66,1.98 33.68,1.96 33.68,-0.91 3.53,-0.91 3.53,1.96 3.53,1.98 3.71,1.98
  cutout Bottom: 6.05,28.09 6.05,25.15 36.4,25.15 36.4,28.09
ILIM
  Top 0.203: U1.10 30.51,15.65 32.07,17.21 32.32,17.21 32.34,17.23 R33.1
N$1  (via drill 0.2 pad 0.41)
  Top 0.203: U1.12 29.51,15.83 v29.46,15.88 | R1.1 30.71,17.75 v30.48,17.75
  Bottom 0.203: v30.48,17.75 30.48,16.56 29.79,15.88 v29.46,15.88
N$2
  Top 0.203: R11.1 R44.2
N$3
  Top 0.203: R44.1 36.16,13.57 D5.A
N$5
  Top 0.203: C14.1 R17.1 R9.2 4.28,8.71 5.19,9.62 5.19,10.02 5.94,10.77 U$2.3
N$6
  Top 0.203: U$3.3 15.27,10.82 14.89,10.43 14.89,9.49 R5.2 R6.1 C28.1
N$7
  Bottom 1.016: U$1.P$7 19.73,1.14 | 19.73,1.14 19.73,3.54 19.27,4 CONN2.6 | U$1.7 19.73,1.14
N$8  (via drill 0.2 pad 0.41)
  Top 0.203: R8.1 4.93,4.97 v4.95,4.95 | R17.2 3.29,7.32 v2.59,7.32
  Route15 0.203: v2.59,7.32 2.59,6.25 3.89,4.95 v4.95,4.95
N$9  (via drill 0.2 pad 0.41)
  Top 0.203: R6.2 12.92,7.32
  Top 0.305: 12.92,7.32 v12.34,7.32 | R4.1 13.9,4.25 v13.84,4.19
  Route15 0.305: v12.34,7.32 12.47,7.32 12.83,6.96 12.83,5.21 v13.84,4.19
N$10
  Bottom 1.016: U$1.P$8 22.27,1.76 | CONN2.5 21.81,2.22 22.27,1.76 | U$1.8 22.27,1.76
N$11
  Top 0.305: L3.P$1 18.79,13.67 18.34,14.13 U$3.8
  pour Top (no thermals): 16.87,14.48 21.84,14.48 arc-90 22,14.33 22,13.11 arc-90 21.84,12.95 18.69,12.95 arc-90 18.54,13.11 18.54,13.67 arc90 18.44,13.77 16.76,13.77 arc-90 16.71,13.82 16.71,14.02 16.71,14.43 arc-90 16.76,14.48 16.81,14.48
N$12
  Top 0.254: L1.P$1 10.11,13.38 9.37,14.13 U$2.8 U$2.9
  pour Top (no thermals): 7.42,14.48 9.45,14.48 12.29,14.48 arc-90 12.7,14.07 12.7,13 arc-90 12.5,12.8 9.5,12.8 arc-90 9.4,12.9 9.4,13.36 9.4,13.51 arc90 9.14,13.77 7.52,13.77 7.37,13.77 7.37,14.48
N$13  (via drill 0.2)
  Top 0.152: R13.1 R12.2 v3.56,15.06 | R25.1 12.48,21.22 v12.37,21.11
  Top 0.203: R13.1 4.93,15.42 4.93,14.73 4.94,14.72 U$2.14
  Route15 0.152: v3.56,15.06 3.76,15.27 3.76,19.61 4.17,20.02 5.49,20.02 6.53,21.06 7.14,21.06 8.11,22.02 11.46,22.02 v12.37,21.11
N$14  (via drill 0.2)
  Top 0.152: R14.2 5.94,15.55 | 5.94,15.55 U$2.12 | 5.94,15.55 5.94,15.6 6.5,16.16 6.5,17.75 v6.43,17.83 6.33,17.93 R15.1 | R27.1 v9.37,21.59
  Bottom 0.152: v9.37,21.59 8.3,21.59 7.75,21.03 7.75,20.22 6.43,18.9 v6.43,17.83
N$15
  Top 0.152: U$2.13 5.44,14.76 5.31,14.89 5.31,17.32 R18.1 R16.2
N$16
  Top 0.305: L3.P$2 18.78,11.67 18.24,11.12 17.37,11.12 U$3.7
  pour Top (no thermals): 16.71,11.58 18.34,11.58 arc90 18.59,11.84 18.59,12.14 arc-90 18.69,12.24 21.89,12.24 arc-90 22.05,12.09 22.05,10.67 arc-90 21.95,10.57 17.12,10.57 arc-90 16.71,10.97
N$17
  Top 0.305: L1.P$2 10.89,11.23 U$2.7
  pour Top (no thermals): 7.42,11.58 9.14,11.58 arc90 9.3,11.73 9.3,11.94 arc-90 9.4,12.04 12.4,12.04 arc-90 12.6,11.84 12.6,10.77 arc-90 12.45,10.62 7.42,10.62
N$18
  Top 0.203: U$2.1 4.94,10.97 4.76,10.79 3.68,10.79 3.3,10.41 C25.2
N$19
  Top 0.203: U$3.1 14.17,11.23 12.93,9.99 C36.2
N$20  (via drill 0.2)
  Top 0.152: R26.1 | R26.1 v13.61,21.03
  Top 0.203: R19.2 R20.1 14.27,16.49 v14.27,16.03 U$3.14
  Bottom 0.152: v13.61,21.03 13.61,19.84 14.63,18.82 14.63,16.38 v14.28,16.03 v14.27,16.03
N$21  (via drill 0.2)
  Top 0.152: R28.1 11.35,21.29 v11.61,21.03
  Top 0.203: U$3.12 v15.27,15.52 15.27,16.56 R21.2 15.72,16.56 16,16.84 16,18.31 R22.1
  Bottom 0.152: v11.61,21.03 13.69,18.95 13.69,15.77 13.94,15.52 v15.27,15.52
N$22
  Top 0.203: R23.2 R24.1 14.77,18.41 U$3.13
N$48
  Top 0.203: U4.3 28.13,20.58 R7.2 C5.1
N$49
  Top 0.203: R54.2 27.28,20.95 | 27.28,20.95 27.28,21.96 C6.1 | U4.2 27.4,21.08 27.28,20.95
OTG  (via drill 0.2 pad 0.41)
  Top 0.203: R3.2 36.91,19.64 v36.96,19.68 | U1.8 31.51,15.39 32.15,16.03 v32.28,16.03
  Bottom 0.203: v32.28,16.03 32.28,15.3 32.84,14.73 35.23,14.73 36.3,15.8 36.3,18.21 36.96,18.87 v36.96,19.68
PG  (via drill 0.2)
  Top 0.152: R26.2 R25.2 14.33,22.55 v14.35,22.58
  Bottom 0.152: 10.57,21.67 13.96,21.67 14.33,22.03 14.33,22.55 v14.35,22.58
  Bottom 0.203: U$4.P$11 9.57,25.47
  Bottom 1.016: CONN1.11 10.57,21.67 10.57,22.65 9.57,23.65 9.57,25.47 U$4.11
PMID
  Top 0.254: U1.23 31.51,10.14 31.66,9.99 C74.2 C17.2 31.66,7.15 30.86,6.35 C49.1
  Top 0.305: C49.1 C7.1
  pour Top (no thermals): 31.42,11.4 31.57,11.4 31.57,10.34 arc90 31.85,10.06 arc-90 32.03,9.88 32.03,4.83 arc-90 31.55,4.34 29.79,4.34 arc-90 29.62,4.52 29.62,6.78 arc-90 29.74,6.91 30.89,6.91 arc90 31.42,7.44
REGN  (via drill 0.2 pad 0.41)
  Top 0.152: 33.58,21.21 v33.6,21.23
  Top 0.254: U1.22 31.01,8.79 v30.73,8.51 C65.1
  Top 0.305: R35.1 33.58,21.21
  Route15 0.305: v30.73,8.51 32.26,8.51 37.9,14.15 37.9,20.37 36.45,21.82 34.19,21.82 v33.6,21.23
  Bottom 0.203: v33.6,21.23 33.6,21.18
SCL  (via drill 0.2 pad 0.41)
  Top 0.152: R30.2 33.93,15.09 v34.09,15.24
  Top 0.203: U1.5 33.38,13.71 33.93,14.27 R30.2 | U4.7 32.16,21.08 32.72,21.64 33.5,22.43 35.89,22.43 v35.92,22.4
  Bottom 0.203: v34.09,15.24 34.14,15.29 34.94,15.29 35.84,16.19 35.84,19.72 CONN1.1
  Bottom 1.016: CONN1.1 35.92,19.9 v35.92,22.4 35.92,24.18 34.97,25.13 U$4.P$1 U$4.1
SDA  (via drill 0.2 pad 0.41)
  Top 0.152: R36.2 33.93,16.41 v34.01,16.48
  Top 0.203: R36.2 33.93,15.9 32.74,14.71 U1.6 | U4.8 31.82,21.58 32.11,21.86 v32.11,22.23
  Bottom 0.203: v34.01,16.48 34.03,16.48 34.21,16.67 34.21,21.86 33.97,22.11 33.43,22.64 33.43,23.11
  Bottom 0.305: v32.11,22.23 32.87,22.23 33.43,22.79 33.43,23.11
  Bottom 1.016: U$4.P$2 32.43,25.08 33.43,24.08 CONN1.2 33.43,23.11
  Bottom 1.27: U$4.2 U$4.P$2
STAT
  Top 0.203: U1.4 34.46,13.21 D5.C
SW1
  Top 0.254: L7.P$1 27.27,10.08 | C2.2 29.21,10.03 29.51,10.33 U1.19 29.51,10.36 30.01,10.86 U1.20
  Top 0.305: L7.P$1 29.16,10.08 29.21,10.03
  pour Top (no thermals): 29.46,11.38 30.02,11.38 arc-90 30.12,11.28 30.12,10.57 30.12,10.41 arc-90 29.67,9.96 27.48,9.96 arc90 26.92,9.4 26.92,8.84 arc-90 26.62,8.53 25.86,8.53 23.72,8.53 arc-90 23.52,8.74 23.52,10.77 arc-90 23.93,11.18 29.11,11.18 29.21,11.18 arc90 29.26,11.23 arc-90 29.41,11.38
TS  (via drill 0.2 pad 0.41)
  Top 0.203: U1.11 30.01,15.79 31.15,16.92 R1.2 31.76,17.84 31.76,18.57 | R34.1 R35.2 32.72,19.64 31.76,18.68 31.76,18.57 | 31.76,18.57 v31.78,18.59
  Bottom 0.203: v31.78,18.59 31.66,18.46 29.56,18.46 29.04,18.98 29.04,20.99 28.35,21.68 CONN1.4
  Bottom 1.016: U$4.P$4 27.35,24.87 28.35,23.87 CONN1.4
  Bottom 1.27: U$4.4 U$4.P$4
VBAT  (via drill 0.2 pad 0.41)
  Top 0.203: C3.1 28.84,18.44 C73.1 C72.1 28.84,14.27 U1.13
  Top 0.305: R54.1 25.88,20.86 v25.5,21.23
  Bottom 0.152: 20.23,25.03 19.73,25.53 | U$4.P$7 19.73,25.61 21.01,24.34 22.43,24.34 23.27,23.5 CONN1.6
  Bottom 0.203: 27.57,18.52 v28.02,18.52 | 27.56,17.78 27.56,17.27 | 27.51,18.06 v28.02,18.06 | v28.02,18.95 v28.02,17.63
  Bottom 0.508: v25.5,21.23 25.5,20.16 CONN1.5
  Bottom 1.016: CONN1.7 20.73,24.53 20.23,25.03 | U$4.P$6 22.27,24.7 23.27,23.7 | 23.27,24.58 23.27,23.7 | U$4.P$5 24.81,25.22 24.18,24.58 23.27,24.58 | CONN1.5 25.81,20.61 CONN1.6 23.27,23.7 | 20.68,24.58 23.27,24.58 | 19.79,25.47 19.73,25.53 U$4.P$7 | 19.79,25.47 20.23,25.03 | 19.79,25.47 19.73,25.47 20.17,25.03 20.23,25.03
  Bottom 1.27: U$4.5 U$4.P$5 | U$4.6 U$4.P$6 | U$4.7 U$4.P$7
  other vias: 28.02,17.17 28.02,16.71
  pour Top (no thermals): 27.99,19.13 28.96,19.13 arc-90 29.13,18.95 29.13,13.72 arc-90 29.06,13.64 27.97,13.64 arc-90 27.86,13.74 27.86,19 arc-90
  pour Bottom (no thermals): 25.4,20.83 27.81,20.83 arc-90 28.57,20.07 28.57,16.76 arc-90 28.32,16.51 27.48,16.51 arc-90 27.23,17.48 27.23,18.49 arc90 26.92,18.8 25.4,18.8 arc-90 25.27,18.92 25.27,20.7 arc-90
VCC  (via drill 0.2 pad 0.41)
  Top 0.305: R11.2 36.83,18.19 v36.91,18.11 | L14.1 15.33,4.53 v15.01,4.22
  Route15 0.305: v36.91,18.11 36.6,17.8 36.6,14.17 32.08,9.65 20.17,9.65 15.01,4.5 v15.01,4.22
  Bottom 0.152: 16.73,3.48 16.73,3.05
  Bottom 0.203: CONN2.7 16.73,4.28 16.59,4.42
  Bottom 0.305: 14.65,1.17 14.65,3.83 | 14.65,3.83 15.39,4.57 | U$1.5 14.65,1.17 | 14.65,3.83 14.65,4.17 L14.1 | v15.01,4.22 15.01,1.53 14.65,1.17
  Bottom 0.508: 15.39,5.61 15.39,6.84 15.09,7.15 14.83,6.89 14.83,3.15
  Bottom 0.762: 16.73,3.48 CONN2.7 16.73,2.48
  Bottom 1.016: 15.39,4.57 16.19,4.57 16.68,5.06 16.68,3.9 CONN2.7 16.7,3.88 | 15.39,4.57 14.83,4.57 14.83,3.15 14.83,0.78 U$1.P$5 U$1.5 | U$1.P$6 17.19,2.02 16.73,2.48 | 16.73,3.05 16.73,2.48 | 16.7,5.08 16.7,6.22 15.78,7.15 15.09,7.15 CONN2.8 | 16.7,5.08 16.7,3.88 | 16.7,3.88 16.7,2.51 16.73,2.48 | 15.39,4.57 15.39,5.61 | 16.7,5.08
  Bottom 1.27: U$1.6 U$1.P$6
  pour Bottom (no thermals): 13.21,8.15 16.56,8.15 arc-90 17.2,7.52 17.16,4.62 13.61,4.64 arc-90 13.21,5.04
VIN  (via drill 0.2 pad 0.41)
  Top 0.203: v37.13,10.72 36.36,10.72 C64.1
  Top 0.254: U1.24 32.77,10.99 | 32.77,10.99 33.63,10.99 C10.2 | U1.1 32.77,11.69 32.77,10.99 | C20.2 35.2,9.43 C57.1
  Top 0.305: 36.28,10.72 C9.2 C10.2 C11.2 C20.2 | 36.28,10.72 C64.1 | C57.1 36.28,9.47 36.28,10.72
  Bottom 1.016: U$1.P$11 29.89,2.97 | 29.89,2.97 29.89,3.85 CONN2.1 | U$1.P$12 32.43,2.93 31.97,3.39 CONN2.1 | CONN2.1 31.97,6.28 31.1,7.15 CONN2.2 | CONN2.2 29.43,9.39 30.12,10.08 v36.65,10.08 | CONN2.2 29.49,7.09 29.49,3.37 29.89,2.97
  Bottom 1.27: U$1.11 U$1.P$11 | U$1.12 U$1.P$12
  other vias: 37.11,10.24 37.11,9.73 36.14,10.08 35.61,10.08 37.11,9.25
  pour Top (no thermals): 32.38,11.84 33.15,11.84 arc-90 33.25,11.73 33.25,11.13 arc90 33.38,11 37.21,11 arc-90 37.52,10.69 37.52,9.4 arc-90 37.08,8.97 33.53,8.97 arc-90 33.43,9.07 33.43,10.21 arc90 33.22,10.41 32.03,10.41 arc-90 31.9,10.54 31.9,11.38 32.36,11.38 arc90 32.38,11.4
  pour Bottom (no thermals): 37.52,11.38 30.18,11.38 arc90 28.7,9.91 28.7,2.74 arc90 29.29,2.16 32.44,2.16 arc90 33.53,3.25 33.53,8.31 arc-90 34.11,8.89 37.57,8.89 arc90 37.72,9.04 37.72,11.18 arc90
VSYS  (via drill 0.2 pad 0.41)
  Top 0.152: 2.87,18.9 v2.85,18.92
  Top 0.203: U$2.10 6.99,14.18 6.99,16.93 C13.2 | R21.1 v15.34,18.06 | v13.06,20.6 R23.1 | C27.2 18.15,17.38 C26.1 20.42,17.04 C33.1 | C21.2 C1.2 C4.2 C8.2 23.58,17.84 24.46,16.95 24.62,16.95 C59.1 C58.1 24.68,14.08 L7.P$2 | U1.15 26.16,13.21 26.11,13.26 | U1.16 26.08,12.71 26.06,12.7
  Top 0.305: R14.1 v5.84,17.14 | R16.1 2.87,18.9
  Top 1.016: 23.25,21.64 v22.86,21.64
  Route15 0.305: v5.84,17.14 10.36,17.14 11.25,16.26 v11.25,15.82
  Bottom 0.203: v20.02,15.7 19.96,15.65
  Bottom 0.305: v2.85,18.92 2.87,18.95 4.04,18.95 v5.84,17.14
  other vias: 10.24,15.82 10.74,15.82 11.76,15.82 10.24,15.32 10.74,15.32 11.25,15.32 11.76,15.32 20.52,15.7 21.03,15.7 21.54,15.7 20.02,15.19 20.52,15.19 21.03,15.19 21.54,15.19 22.86,21.13 22.86,20.62 22.35,21.64 22.35,21.13 22.35,20.62 22.86,20.12 22.35,20.12
  pour Top (no thermals): 29.06,13.31 arc-90 29.21,13.16 29.21,12.75 arc-90 29.06,12.6 23.67,12.6 23.67,16.41 arc90 23.37,16.71 arc-90 22.86,17.22 22.86,22.35 arc-90 23.16,22.66 23.77,22.66 arc-90 23.93,22.5 23.93,18.14 arc90 24.08,17.98 24.84,17.98 arc-90 25.1,17.73 25.1,14.88 arc90 25.45,14.53 26.97,14.53 arc-90 27.43,14.07 27.43,13.46 arc90 27.58,13.31
  pour Top (no thermals): 15.65,15.39 15.65,13.87 arc90 15.75,13.77 16.36,13.77 16.36,14.78 arc-90 16.61,15.04 21.64,15.04 arc90 21.95,15.34 21.95,16.92 arc90 21.49,17.37 16.76,17.37 arc90 16.56,17.17 16.56,16.05 arc-90 16.46,15.95 16.21,15.95 arc90
  pour Top (no thermals): 6.86,16.92 6.86,15.54 arc-90 6.5,15.19 arc90 6.3,14.99 6.3,13.92 arc90 6.45,13.77 7.01,13.77 arc90 7.04,13.79 7.04,14.66 arc-90 7.34,14.96 12.01,14.96 arc90 12.04,14.99 12.04,17.12 arc90 11.94,17.22 7.16,17.22 arc90
  pour Route15: 10.03,16.38 10.03,14.99 arc90 10.16,14.86 23.62,14.86 arc90 23.88,15.11 23.88,21.72 arc90 23.5,22.1 22.23,22.1 11.68,22.1 10.16,22.1 arc90 10.03,21.97
  pour Top (no thermals): 23.67,22.71 22.5,22.71 arc90 22.07,22.28 22.07,20.09 arc90 22.56,19.61 arc-90 22.86,19.3 22.86,19.18 arc-90 22.89,19.2 23.93,19.2 arc90 23.95,19.23 23.95,22.43 arc90
  pour Bottom: 9.96,16.13 11.89,16.13 arc-90 12.06,15.95 12.06,15.06 arc-90 11.96,14.96 11.56,14.96 9.98,14.96 arc-90 9.86,15.09 9.86,15.54 9.86,16.05 arc-90 9.93,16.13
  pour Bottom: 22.1,21.92 23.11,21.92 arc-90 23.22,21.82 23.22,19.99 arc-90 23.01,19.79 22.07,19.79 arc-90 21.87,19.99 21.87,21.69 arc-90
  pour Bottom: 19.86,16 21.64,16 arc-90 21.87,15.77 21.87,15.14 arc-90 21.64,14.91 19.81,14.91 arc-90 19.74,14.99 19.74,15.88 arc-90
  pour Top (no thermals): 23.72,14.43 24.31,14.43 arc90
  pour Top (no thermals): 16.59,17.6 21.64,17.6 arc90 22.07,18.03 22.07,22.28 arc-90 22.5,22.71 23.75,22.71 arc-90 23.93,22.53 23.93,14.68 arc-90 23.75,14.5 23.75,14.55 23.75,14.78 23.75,14.81 arc90 23.52,15.04 16.59,15.04 16.59,17.58 arc90 16.56,17.6

### Text on the board
Top: T1
Route2: G2
Route15: P3
Bottom: B4
tPlace: EN | PG | RST | GND | GND | VBAT | VBAT | VBAT | TS | !INT | SDA | SCL | NR3015T2R2M | NC | NC | 3V3 | 3V3 | 5VDC | 5VDC | VCC | VCC | GND | GND | VIN | VIN
bPlace: ELEKTRA-PMIC v0.1 | 20240111
Reference: 40*27mm